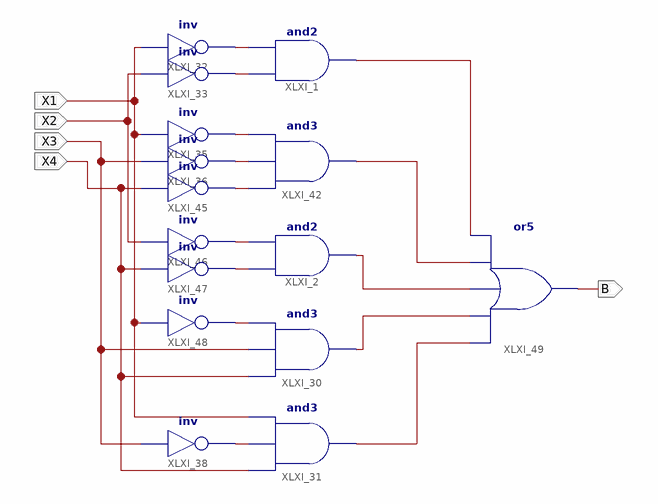
[diagram p0: schematic sheet 1]
// Xilinx ISE schematic bin7seg_b.sch (spartan3e) as structural Verilog: 15 symbols, 5 ports
module bin7seg_b (
  input  X1,
  input  X2,
  input  X3,
  input  X4,
  output B
);

  wire XLXN_1, XLXN_2, XLXN_5, XLXN_8, XLXN_9, XLXN_12, XLXN_14, XLXN_44, XLXN_48, XLXN_50, XLXN_51, XLXN_52,
       XLXN_53, XLXN_54;

  and XLXI_1 (XLXN_8, XLXN_2, XLXN_1);
  and XLXI_31 (XLXN_44, X4, XLXN_5, X1);
  not XLXI_32 (XLXN_1, X1);
  not XLXI_33 (XLXN_2, X2);
  not XLXI_35 (XLXN_48, X1);
  not XLXI_36 (XLXN_50, X3);
  not XLXI_38 (XLXN_5, X3);
  and XLXI_30 (XLXN_14, X4, X3, XLXN_54);
  and XLXI_2 (XLXN_12, XLXN_53, XLXN_52);
  and XLXI_42 (XLXN_9, XLXN_51, XLXN_50, XLXN_48);
  not XLXI_45 (XLXN_51, X4);
  not XLXI_46 (XLXN_52, X2);
  not XLXI_47 (XLXN_53, X4);
  not XLXI_48 (XLXN_54, X1);
  or XLXI_49 (B, XLXN_44, XLXN_14, XLXN_12, XLXN_9, XLXN_8);
endmodule
